# Altium schematic sheet MicroSpecSensorBoard_adc_V2_1.SchDoc
size A4
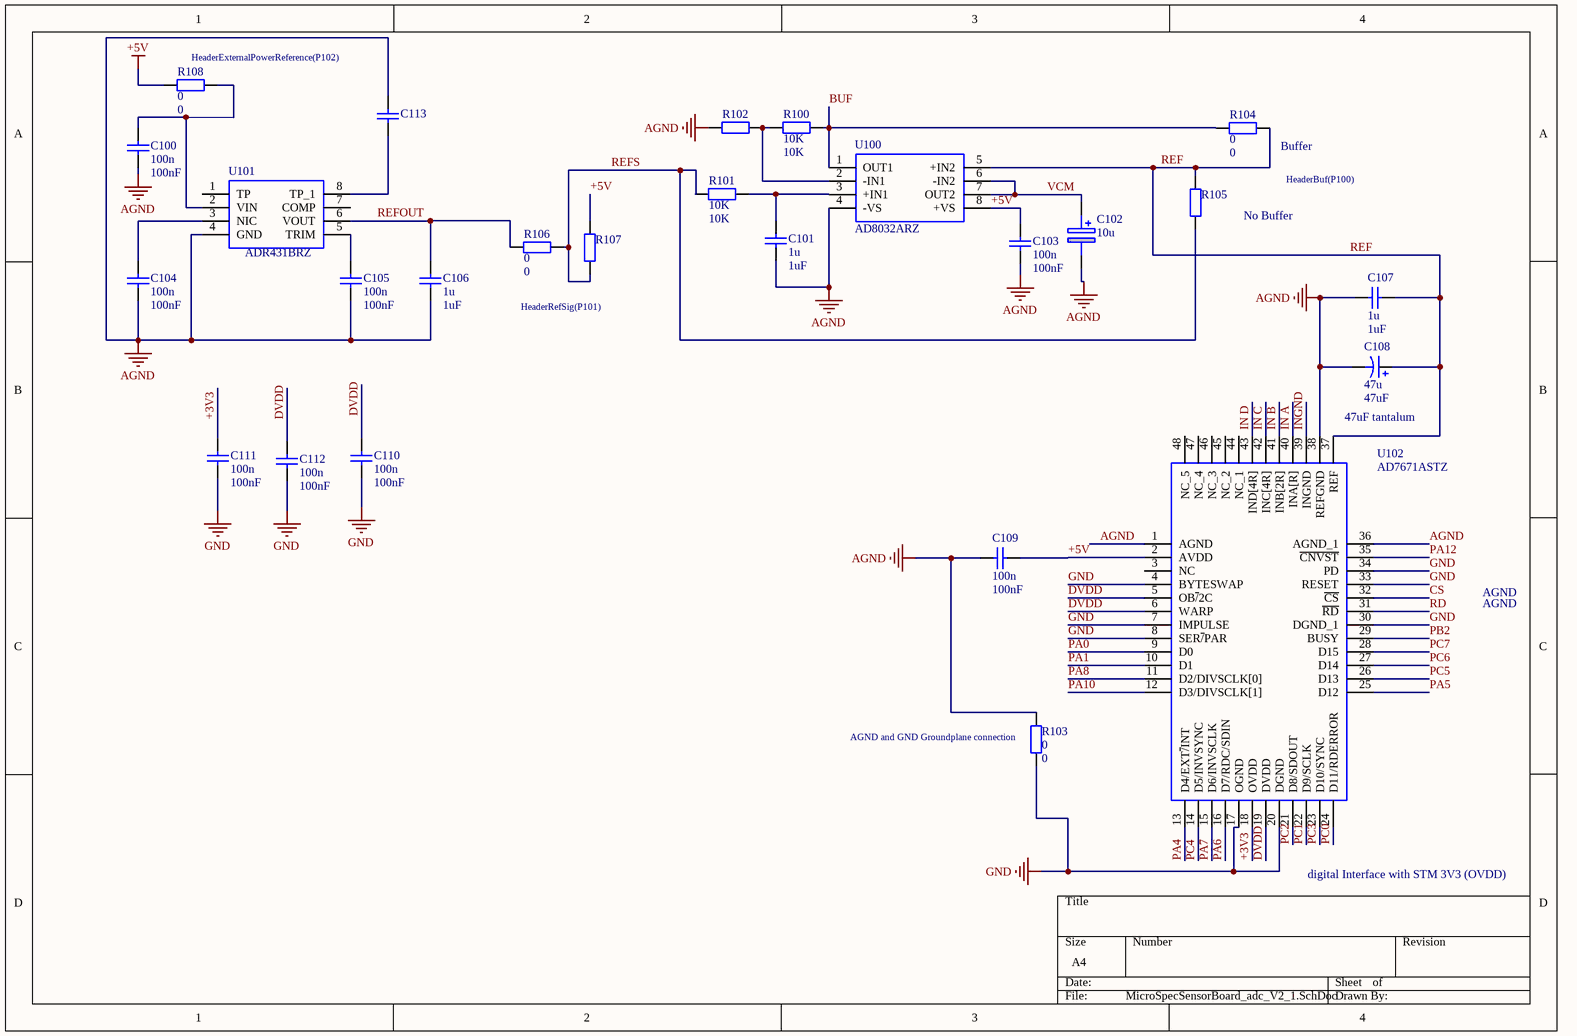
[diagram p0: MicroSpecSensorBoard_adc_V2_1.SchDoc]

## Parts
C100  100n  value 100nF  [6-0805_L]
C101  1u  value 1uF  [6-0805_L]
C102  10u  [FKV(D)]
C103  100n  value 100nF  [6-0805_L]
C104  100n  value 100nF  [6-0805_L]
C105  100n  value 100nF  [6-0805_L]
C106  1u  value 1uF  [6-0805_L]
C107  1u  value 1uF  [6-0805_L]
C108  47u  value 47uF  [CAPCP-3216-18N]
C109  100n  value 100nF  [6-0805_L]
C110  100n  value 100nF  [6-0805_L]
C111  100n  value 100nF  [6-0805_L]
C112  100n  value 100nF  [6-0805_L]
C113  (no value)  [6-0805_N]
R100  10K  [6-0805_L]
R101  10K  [6-0805_L]
R102  (no value)  [6-0805_L]
R103  0  [6-0805_L]
R104  0  [6-0805_L]
R105  (no value)  [6-0805_L]
R106  0  [6-0805_L]
R107  (no value)  [6-0805_L]
R108  0  [6-0805_L]
U100  AD8032ARZ  [SOIC127P600X175-8N]
U101  ADR431BRZ  [SOIC127P600X175-8N]
U102  AD7671ASTZ  [QFP50P900X900X160-48N]

## Nets
+5V: C103.1 C109.2 R107.2 R108.2 U100.8(+VS) U102.2(AVDD)
AGND: C100.2 C101.2 C102.2(-) C103.2 C104.2 C105.2 C106.2 C107.1 C108.2 C109.1 C113.1 R102.1 R103.2 U100.4(-VS) U101.4(GND) U102.1(AGND) U102.36(AGND_1) U102.38(REFGND)
GND: C110.2 C111.2 C112.2 R103.1 U102.4(BYTESWAP) U102.7(IMPULSE) U102.8(SER~{/}PAR) U102.17(OGND) U102.20(DGND) U102.30(DGND_1) U102.33(RESET) U102.34(PD)
+3V3: C111.1 U102.18(OVDD)
BUF: R100.2 R104.2 U100.1(OUT1)
CS: U102.32(~{CS})
DVDD: C110.1 C112.1 U102.5(OB~{/}2C) U102.6(WARP) U102.19(DVDD)
IN A: U102.40(INA[R])
IN B: U102.41(INB[2R])
IN C: U102.42(INC[4R])
IN D: U102.43(IND[4R])
INGND: U102.39(INGND)
PA0: U102.9(D0)
PA1: U102.10(D1)
PA4: U102.13(D4/EXT~{/}INT)
PA5: U102.25(D12)
PA6: U102.16(D7/RDC/SDIN)
PA7: U102.15(D6/INVSCLK)
PA8: U102.11(D2/DIVSCLK[0])
PA10: U102.12(D3/DIVSCLK[1])
PA12: U102.35(~{CNVST})
PB2: U102.29(BUSY)
PC0: U102.24(D11/RDERROR)
PC1: U102.22(D9/SCLK)
PC2: U102.21(D8/SDOUT)
PC3: U102.23(D10/SYNC)
PC4: U102.14(D5/INVSYNC)
PC5: U102.26(D13)
PC6: U102.27(D14)
PC7: U102.28(D15)
RD: U102.31(~{RD})
REF: C107.2 C108.1 R104.1 R105.2 U100.5(+IN2) U102.37(REF)
REFOUT: C106.1 R106.2 U101.6(VOUT)
REFS: R101.1 R105.1 R106.1 R107.1
VCM: C102.1(+) U100.6(-IN2) U100.7(OUT2)
NetC100_1: C100.1 R108.1 U101.2(VIN)
NetC101_1: C101.1 R101.2 U100.3(+IN1)
NetC104_1: C104.1 U101.3(NIC)
NetC105_1: C105.1 U101.5(TRIM)
NetC113_2: C113.2 U101.8(TP_1)
NetR100_1: R100.1 R102.2 U100.2(-IN1)

Not connected (* = marked no-connect by the designer): U101 1(TP) 7(COMP); U102 3(NC) 44(NC_1) 45(NC_2) 46(NC_3) 47(NC_4) 48(NC_5)

## Notes on the sheet
- (near R108) HeaderExternalPowerReference(P102)
- (near R104) Buffer
- HeaderBuf(P100)
- (near R105) No Buffer
- HeaderRefSig(P101)
- 47uF tantalum
- AGND
- (near R103) AGND and GND Groundplane connection
- digital Interface with STM 3V3 (OVDD)

## Library data of the parts
C100 C101 C103-C107 C109-C112 = Cap: Capacitor; Published: 8-Jun-2000; LatestRevisionDate: 17-Jul-2002; LatestRevisionNote: Re-released for DXP Platform.; PackageReference: RAD-0.3; Publisher: Altium Limited; PackageDescription: Radial Cap, Thru-Hole; 2 Leads; 0.3 in Pin Spacing
C102 = EEEFK1J100P: Ecap 10uF; Manufacturer_Name: Panasonic; Allied_Number: 70256560; RS Part Number: 7083588P; Manufacturer_Part_Number: EEEFK1J100P; Datasheet Link: http://uk.rs-online.com/web/p/products/7083588P
C108 = Cap Pol2: Polarized Capacitor (Axial); Published: 8-Jun-2000; LatestRevisionDate: 17-Jul-2002; LatestRevisionNote: Re-released for DXP Platform.; PackageReference: POLAR0.8; Publisher: Altium Limited; PackageDescription: Polarized Capacitor; 2 Leads
C113 = Cap_1: Capacitor not populated; Published: 8-Jun-2000; LatestRevisionDate: 17-Jul-2002; LatestRevisionNote: Re-released for DXP Platform.; PackageReference: RAD-0.3; Publisher: Altium Limited; PackageDescription: Radial Cap, Thru-Hole; 2 Leads; 0.3 in Pin Spacing
R100 R101 R103-R108 = Res2: Resistor; Published: 8-Jun-2000; LatestRevisionDate: 17-Jul-2002; LatestRevisionNote: Re-released for DXP Platform.; PackageReference: AXIAL-0.4; Publisher: Altium Limited; PackageDescription: Axial Device, Thru-Hole; 2 Leads; 0.4 in Pin Spacing
  R100 R101: Value: 10K
  R103 R104 R106 R108: Value: 0
R102 = Res2: Resistor not populated; Published: 8-Jun-2000; LatestRevisionDate: 17-Jul-2002; LatestRevisionNote: Re-released for DXP Platform.; PackageReference: AXIAL-0.4; Publisher: Altium Limited; PackageDescription: Axial Device, Thru-Hole; 2 Leads; 0.4 in Pin Spacing
U100 = AD8032ARZ: Analog Devices AD8032ARZ, Dual Op Amp Rail-Rail, 5 V, 8-Pin SOIC; Manufacturer_Name: Analog Devices; Manufacturer_Part_Number: AD8032ARZ; RS Part Number: 0195105P; RS Price/Stock: http://uk.rs-online.com/web/p/products/0195105P; Arrow Part Number: AD8032ARZ; Arrow Price/Stock: http://uk.rs-online.com/web/p/products/0195105P; Datasheet Link: *
U101 = ADR431BRZ: ADR431BRZ, Precision Voltage Reference 2.499 to 2.501V, 0.04% 30mA 20V max. 8-Pin SOIC; Manufacturer_Name: Analog Devices; Geometry.Height: 1.75mm; Manufacturer_Part_Number: ADR431BRZ; RS Part Number: 9126366; RS Price/Stock: http://uk.rs-online.com/web/p/products/9126366; Arrow Part Number: ADR431BRZ; Arrow Price/Stock: https://www.arrow.com/en/products/adr431brz/analog-devices; Datasheet Link: http://www.analog.com/static/imported-files/data_sheets/ADR430_431_433_434_435.pdf
U102 = AD7671ASTZ: AD7671ASTZ, 16-Bit Analogue to Digital Converter, Serial, 48-Pin LQFP; Manufacturer_Name: Analog Devices; Geometry.Height: 1.6mm; Manufacturer_Part_Number: AD7671ASTZ; RS Part Number: 1580250; RS Price/Stock: http://uk.rs-online.com/web/p/products/1580250; Arrow Part Number: AD7671ASTZ; Arrow Price/Stock: https://www.arrow.com/en/products/ad7671astz/analog-devices; Datasheet Link: http://www.analog.com/static/imported-files/data_sheets/AD7671.pdf